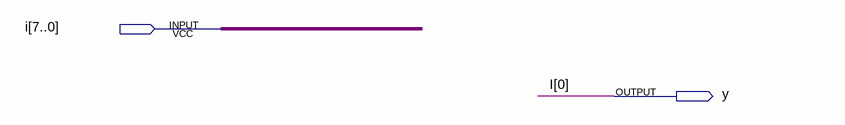
[diagram p0: schematic sheet]
// Quartus schematic CUT7BIT.bdf as structural Verilog: 0 symbols, 2 pins
module CUT7BIT (
  input  [7:0] i,
  output y
);


  assign y = i[0];
endmodule
